# EAGLE design pogo_pin_programmer_adapter (EAGLE 9.1.0)
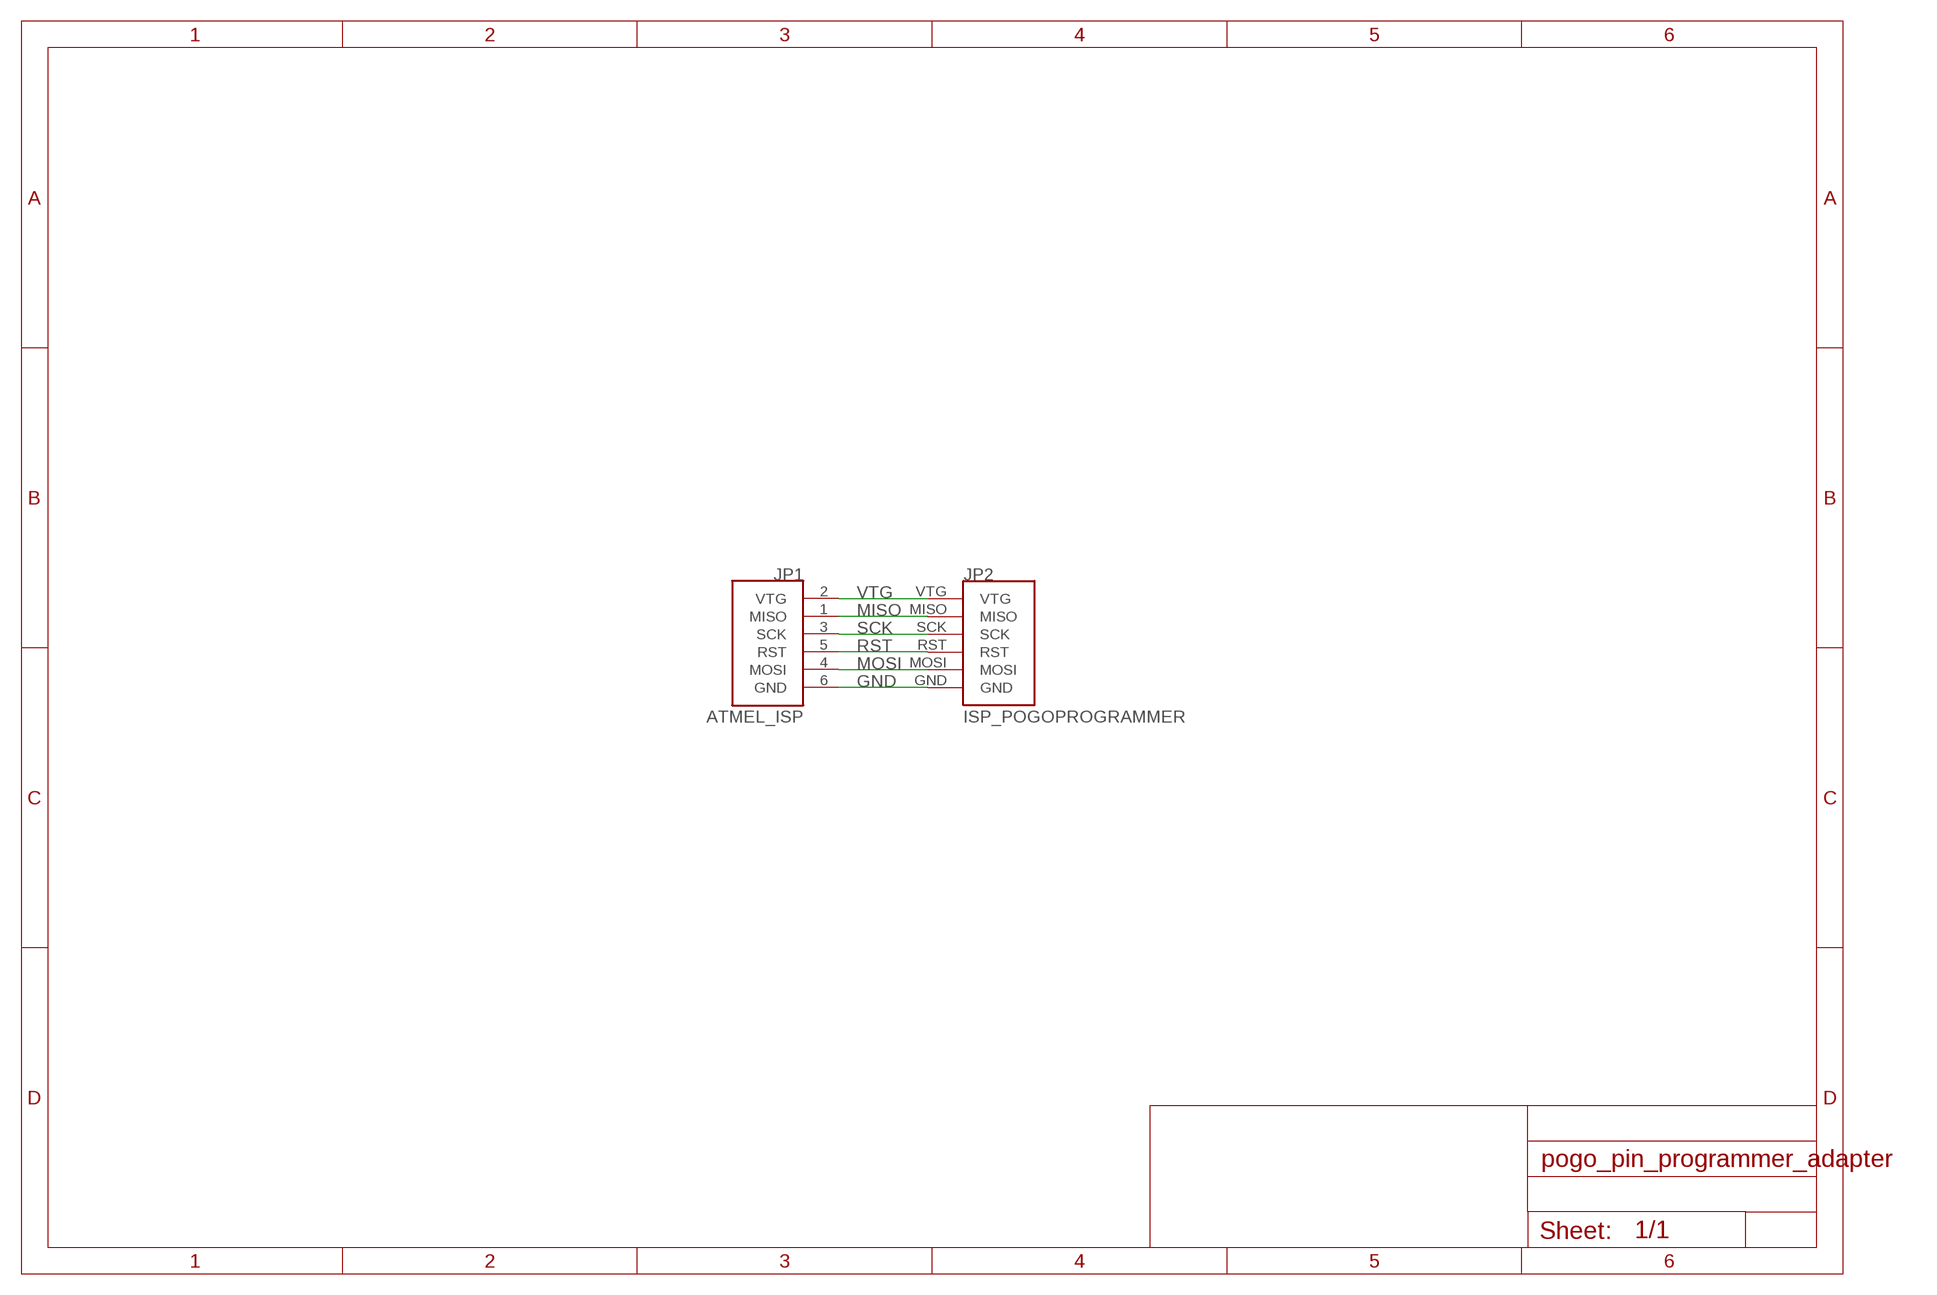
[diagram p0: schematic, sheet 1]

## Parts
JP1  ATMEL_ISP  [2X03]
JP2  ISP_POGOPROGRAMMER  [ISP_POGO]

## Nets
GND: JP1.6(GND) JP2.GND
MISO: JP1.1(MISO) JP2.MISO
MOSI: JP1.4(MOSI) JP2.MOSI
RST: JP1.5(RST) JP2.RST
SCK: JP1.3(SCK) JP2.SCK
VTG: JP1.2(VTG) JP2.VTG

## Library data of the parts
JP1 = connectors:ATMEL_ISP
JP2 = connectors:ISP_POGO

## Board
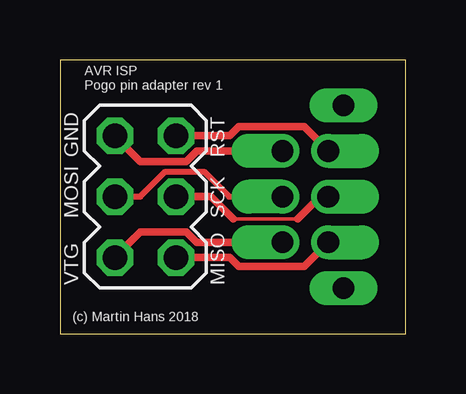
[diagram p1: board, top side]
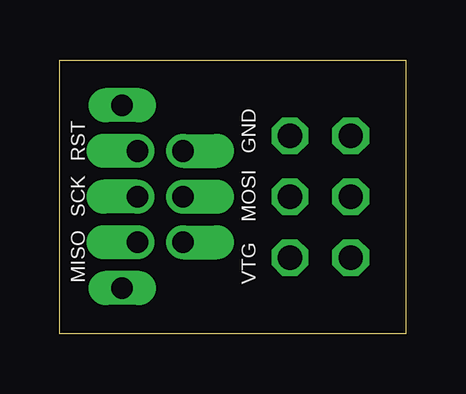
[diagram p2: board, bottom side, seen from below]

Size 14.4 x 11.42 mm. Coordinates in mm from the lower left corner, seen from the top.
Outline: 0,0 14.4,0 14.4,11.42 0,11.42 0,0
Copper layers (1*16): Top 0.035mm / dielectric 1.5mm / Bottom 0.035mm
Design rules "default": minimum track width 6mil, minimum drill 0.35mm, track to track 6mil, track to pad 6mil, pad to pad 6mil, via to via 6mil, smd to smd 6mil, copper to edge 40mil, drill to drill 6mil, minimum pad ring 10mil, minimum via ring 8mil, stop-mask expansion 4mil, vias tented up to drill 0mil, thermal gap 10mil

### Footprints (pad centres in the part's own frame; a part is rotated, then mirrored left to right if it is on the bottom)
2X03 = drill 1.016 octagon: 1 -1.27,2.54; 2 1.27,2.54; 3 -1.27,0; 4 1.27,0; 5 -1.27,-2.54; 6 1.27,-2.54
ISP_POGO = drill 0.9 offset: GND 0,-1.905; MISO 3.81,0; MOSI 1.905,-1.905; RST 0,0; SCK 1.905,0; VTG 3.81,-1.905 | drill 0.9 pad 1.27 long: NC1 5.715,0.635; NC2 -1.905,0.635

### Placement (x,y rotation side)
JP1  3.56,5.71 180 top
JP2  11.18,7.62 270 top

### Tracks (layer width: path | path; a pad name or v marks a point on that pad's centre or on a via)
GND
  Top 0.305: JP2.GND 5.7,7.62 5.27,7.19 3.35,7.19 JP1.6
MISO
  Top 0.305: JP1.1 7.07,3.17 7.45,2.8 10.17,2.8 JP2.MISO
MOSI
  Top 0.254: JP2.MOSI 7.05,5.71 6.01,6.76 4.39,6.76 3.35,5.71 JP1.4
RST
  Top 0.305: JP1.5 7.07,8.26 7.45,8.63 10.17,8.63 JP2.RST
SCK
  Top 0.152: 9.91,4.78 7.22,4.78
  Top 0.305: JP2.SCK 10.84,5.71 9.91,4.78 | JP1.3 6.29,5.71 7.22,4.78
VTG
  Top 0.305: JP2.VTG 5.7,3.81 5.27,4.24 3.35,4.24 JP1.2

### Text on the board
tPlace: AVR ISP / Pogo pin adapter rev 1 | GND | RST | MOSI | SCK | VTG | MISO | (c) Martin Hans 2018
bPlace: GND | RST | MOSI | SCK | VTG | MISO